# EAGLE schematic LCmeter0-LCD3310-PICCOMP (EAGLE 7.2.0)
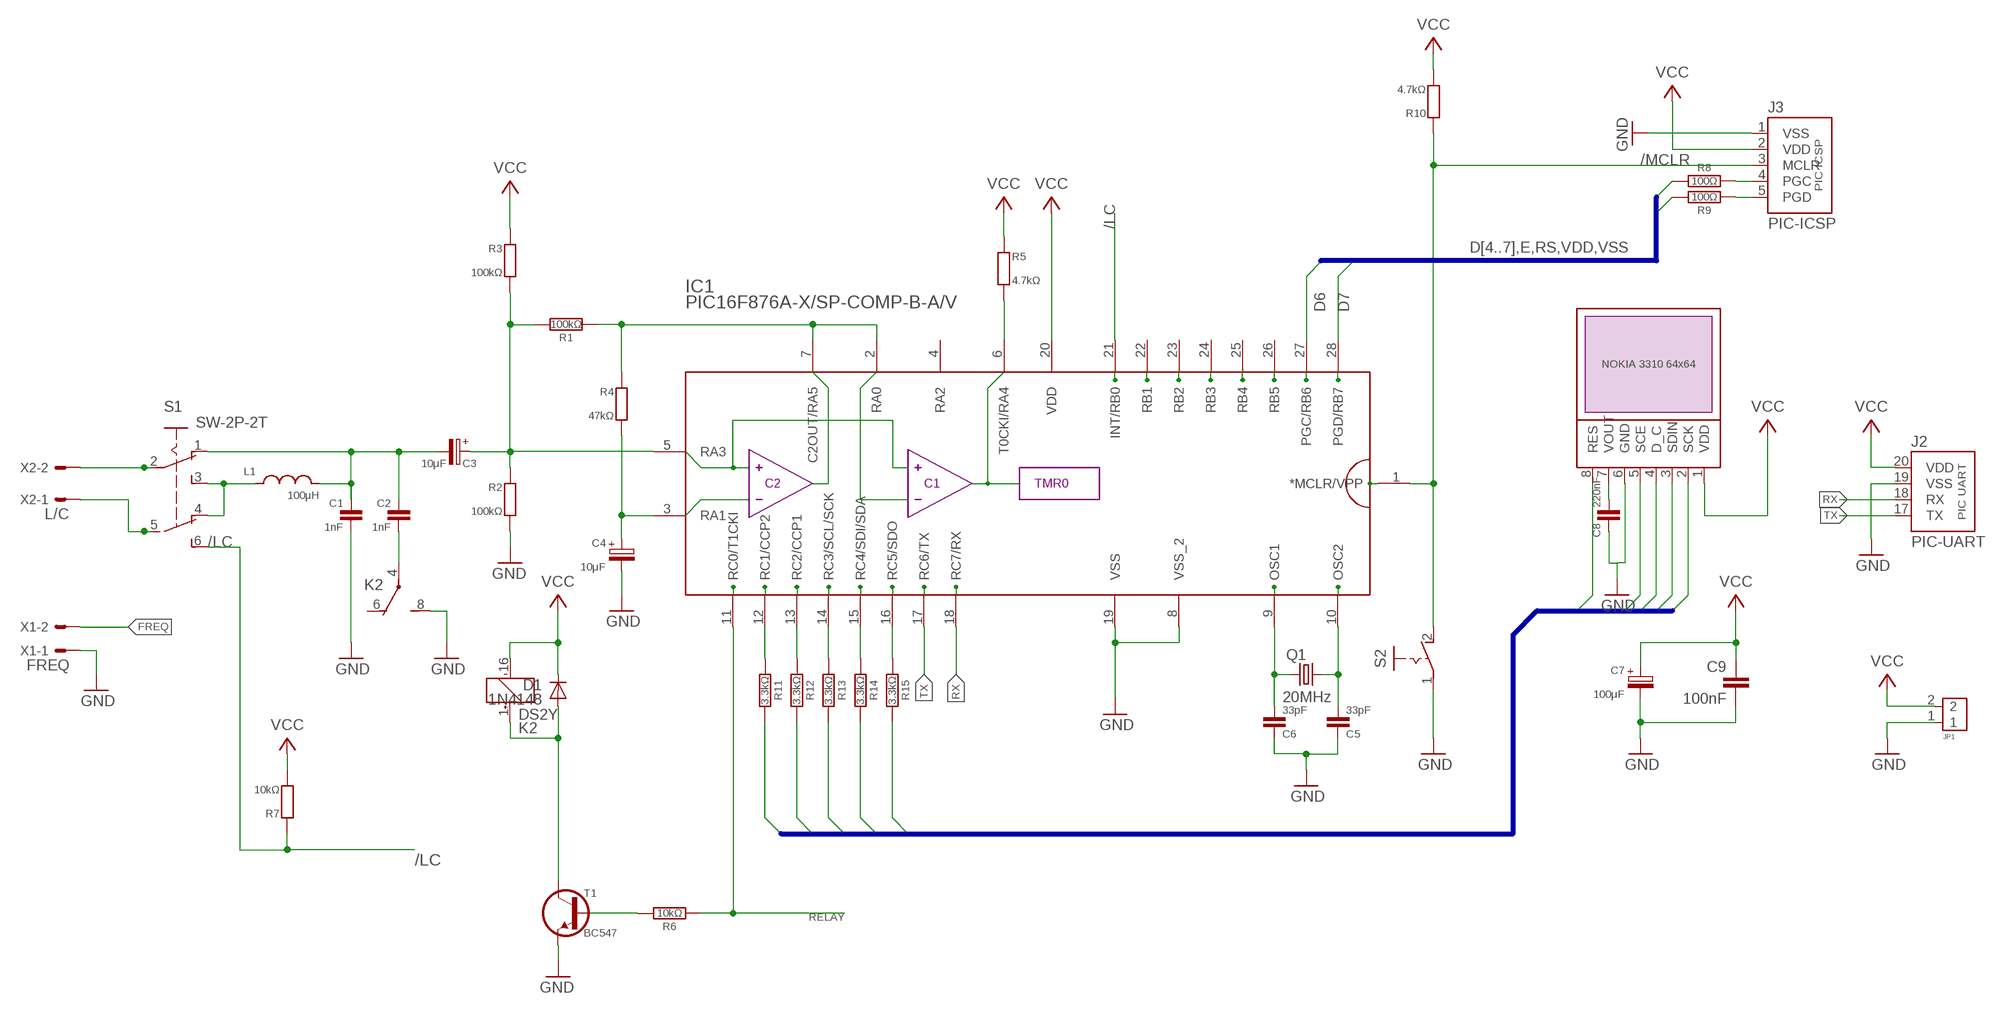
[diagram p0: schematic, sheet 1]

## Parts
C1  1nF  C050-020X036  [C050-020X036]
C2  1nF  C050-020X036  [C050-020X036]
C3  10μF  CPOL-HE2,5-4  [E2,5-4]
C4  10μF  CPOLE2,5-4  [E2,5-4]
C5  33pF  C025-020X036  [C025-020X036]
C6  33pF  C025-020X036  [C025-020X036]
C7  100μF  CPOLE2.5-5  [E2,5-5]
C8  220nF  C-H050-020X044/V  [C050-020X044/V]
C9  100nF  C-EU025-024X044  [C025-024X044]
D1  1N4148  1N414834-7  [DO34-7]
IC1  PIC16F876A-X/SP-COMP-B-A/V  [DIL28-3/V]
J2  PIC-UART  [PIC-UART]
J3  PIC-ICSP  [CONN-5P]
JP1  CONN-2P2P/V  [CONN-2P-V]
K2  DS2Y  DS2Y-S-DC5V  [DS2Y]
L1  100µH  L-SHORT02/5  [L-02/5V]
LCD1  NOKIA-3310-64X64  [1X8]
Q1  20MHz  CRYSTALHC49  [HC49]
R1  100kΩ  R-H0204/10  [0204/10]
R2  100kΩ  R0204/10  [0204/10]
R3  100kΩ  R0204/10  [0204/10]
R4  47kΩ  R0204/10  [0204/10]
R5  4.7kΩ  R0204/10  [0204/10]
R6  10kΩ  R-H0204/10  [0204/10]
R7  10kΩ  R0204/10-V  [0204/10-V]
R8  100Ω  R-H0204/10  [0204/10]
R9  100Ω  R-H0204/10  [0204/10]
R10  4.7kΩ  R0204/10  [0204/10]
R11  3.3kΩ  R-H0204/10  [0204/10]
R12  3.3kΩ  R-H0204/10  [0204/10]
R13  3.3kΩ  R-H0204/10  [0204/10]
R14  3.3kΩ  R-H0204/10  [0204/10]
R15  3.3kΩ  R-H0204/10  [0204/10]
S1  SW-2P-2T  [SLSW-2P2T]
S2  PB-1P-1T  [PB-1P1T]
T1  BC547  [TO92-CBE]
X1  FREQ  C-GRID-02-70543  [70543-02]
X2  L/C  C-GRID-02-70543  [70543-02]

## Nets
/LC: IC1.21(INT/RB0) R7.1 S1.6(S1)
/MCLR: IC1.1(*MCLR/VPP) J3.3(MCLR) R10.1 S2.2(S)
/RELAY: D1.A K2.1(1:+) T1.C
A0: IC1.2(RA0) IC1.7(C2OUT/RA5) R1.1 R4.1
A1: C4.+ IC1.3(RA1) R4.2
A3: C3.+ IC1.5(RA3) R1.2 R2.1 R3.2
A4: IC1.6(T0CKI/RA4) R5.2
C2_CON: C2.2 K2.4(2:P)
D6: IC1.27(PGC/RB6) R9.1
D7: IC1.28(PGD/RB7) R8.1
D_C: LCD1.4(D_C) R13.1
FREQ: X1.2
GND: C1.2 C4.- C5.1 C6.1 C7.- C8.1 C9.2 IC1.8(VSS_2) IC1.19(VSS) J2.19(VSS) J3.1(VSS) JP1.1 K2.8(2:S) LCD1.6(GND) R2.2 S2.1(P) T1.E X1.1
M+: S1.2(P) X2.2
M-: S1.5(P1) X2.1
N$1: J3.4(PGC) R8.2
N$2: C1.1 C2.1 C3.- L1.2 S1.1(O)
N$3: J3.5(PGD) R9.2
N$4: IC1.12(RC1/CCP2) R11.2
N$5: R6.1 T1.B
N$6: IC1.13(RC2/CCP1) R12.2
N$7: L1.1 S1.3(S) S1.4(O1)
N$8: IC1.14(RC3/SCL/SCK) R13.2
N$9: IC1.15(RC4/SDI/SDA) R14.2
N$10: IC1.16(RC5/SDO) R15.2
N$13: C8.2 LCD1.7(VOUT)
OSC1: C6.2 IC1.9(OSC1) Q1.1
OSC2: C5.2 IC1.10(OSC2) Q1.2
RELAY: IC1.11(RC0/T1CKI) R6.2
RES: LCD1.8(RES) R11.1
RX: IC1.18(RC7/RX) J2.18(RX)
SCE: LCD1.5(SCE) R12.1
SCLK: LCD1.2(SCK) R15.1
SDIN: LCD1.3(SDIN) R14.1
TX: IC1.17(RC6/TX) J2.17(TX)
VCC: C7.+ C9.1 D1.C IC1.20(VDD) J2.20(VDD) J3.2(VDD) JP1.2 K2.16(1:-) LCD1.1(VDD) R3.1 R5.1 R7.2 R10.2
Unconnected: IC1.4(RA2) IC1.22(RB1) IC1.23(RB2) IC1.24(RB3) IC1.25(RB4) IC1.26(RB5) K2.6(2:O) K2.9(3:S) K2.11(3:O) K2.13(3:P)

## Buses
D[4..7],E,RS,VDD,VSS
RES,SCE,D_C,SDIN,SCLK

## Library data of the parts
C1 C2 C5 C6 = c:C: CAPACITOR, European symbol
C3 = c:CPOL-H
C4 C7 = c:CPOL: POLARIZED CAPACITOR, European symbol
C8 = c:C-H
C9 = rcl:C-EU: CAPACITOR, European symbol
D1 = d:1N4148
IC1 = mcu:PIC16F876A-X/SP-COMP-B-A
J2 = pinconn:PIC-UART
J3 = pinconn:PIC-ICSP
JP1 = pinconn:CONN-2P
K2 = relay:DS2Y-S-DC*: MINIATURE RELAY NAiS Source: http://www.mew-europe.com/.. en_ds_61005_0023.pdf; MPN: DS2Y-S-DC5V; OC_FARNELL: unknown; OC_NEWARK: 13P3268
L1 = l:L-SHORT
LCD1 = lcd:NOKIA-3310-64X64
Q1 = q:CRYSTAL
R1 R6 R8 R9 R11-R15 = r:R-H
R2-R5 R7 R10 = r:R: RESISTOR, European symbol
S1 = sw:SW-2P-2T
S2 = sw:PB-1P-1T
T1 = t:BC547
X1 X2 = con-molex:C-GRID-02: CONNECTOR wire to board 2.54 mm (0.100") pitch header; OC_FARNELL: unknown; OC_NEWARK: unknown

## Net classes
0 default: clearance 0.381 mm